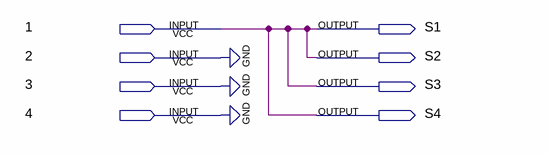
[diagram p0: schematic sheet]
// Quartus schematic shift-right4.bdf as structural Verilog: 0 symbols, 8 pins
module \shift-right4  (
  input  \1 ,
  input  \2 ,
  input  \3 ,
  input  \4 ,
  output S1,
  output S2,
  output S3,
  output S4
);


  assign S1 = \1 ;
  assign S2 = \1 ;
  assign S3 = \1 ;
  assign S4 = \1 ;
  // also tied to GND on the sheet: {\2 , \3 , \4 }
endmodule
